# EAGLE design ChillerDisplay (EAGLE 7.3.0)
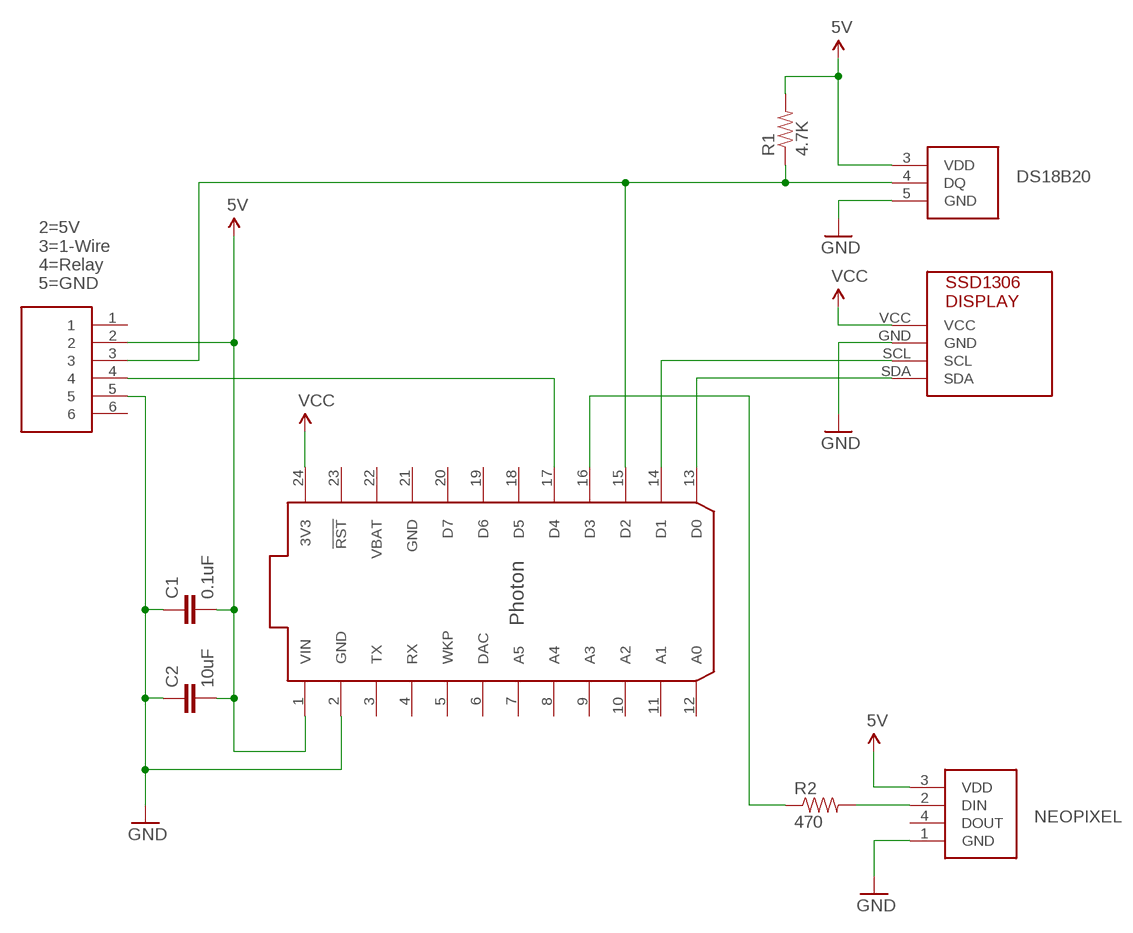
[diagram p0: schematic, sheet 1]

## Parts
C1  0.1uF  CAP-0.1UF-0603  [0603-CAP]
C2  10uF  CAP-10UF-0603  [0603-CAP]
J1  MODULAR-JACK-6P6C-1  [MODULAR-JACK-6P6C-1]
R1  4.7K  RES-4.7K-0603  [0603-RES]
R2  470  RES-470-0603  [0603-RES]
U$1  PHOTON  [PHOTON-SMD]
U$2  SSD1306REV-POL  [SSD1306-REV-POL]
U$3  DS18B208-SOIC  [DS18B20-S0]
U$4  SK6812  [SK6812]

## Nets
5V: C1.2 C2.2 J1.2 R1.2 U$1.1(VIN) U$3.3(VDD) U$4.3(VDD)
GND: C1.1 C2.1 J1.5 U$1.2(GND) U$2.GND U$3.5(GND) U$4.1(GND)
N$1: U$1.13(D0) U$2.SDA
N$2: U$1.14(D1) U$2.SCL
N$7: J1.3 R1.1 U$1.15(D2) U$3.4(DQ)
N$8: R2.2 U$4.2(DIN)
N$9: R2.1 U$1.16(D3)
N$10: J1.4 U$1.17(D4)
VCC: U$1.24(3V3) U$2.VCC
Unconnected: J1.1 J1.6 U$1.3(TX) U$1.4(RX) U$1.5(WKP) U$1.6(DAC) U$1.7(A5) U$1.8(A4) U$1.9(A3) U$1.10(A2) U$1.11(A1) U$1.12(A0) U$1.18(D5) U$1.19(D6) U$1.20(D7) U$1.23(!RST) U$4.4(DOUT)

## Notes on the sheet
- DS18B20
- 2=5V
  3=1-Wire
  4=Relay
  5=GND
- NEOPIXEL

## Power pins joined to a net without a drawn wire
GND: U$1.21(GND)
VBAT: U$1.22(VBAT)

## Library data of the parts
C1 = rickk2:CAP-0.1UF-0603: CAP CER 0.1UF 16V X7R 0603 https://www.digikey.com/product-detail/en/murata-electronics-north-america/GRM188R71C104KA01D/490-1532-1-ND/587771
C2 = rickk2:CAP-10UF-0603: CAP CER 10UF 16V X5R 0805 $ 0.21 https://www.digikey.com/product-detail/en/murata-electronics-north-america/GRM21BR61C106KE15L/490-3886-1-ND/965928
J1 = rickk2:MODULAR-JACK-6P6C-1: CONN MOD JACK 6P6C R/A UNSHLD $0.77 Stewart Connector SS-7066-NF Jack Modular Connector 6p6c (RJ11, RJ12, RJ14, RJ25) 90° Angle (Right) Unshielded Cat5 https://www.digikey.com/product-detail/en/stewart-connector/SS-7066-NF/380-1043-ND/388305
R1 = rickk2:RES-4.7K-0603: RES SMD 4.7K OHM 5% 1/4W 0603 $ 0.11 https://www.digikey.com/product-detail/en/panasonic-electronic-components/ERJ-PA3J472V/P4.7KBZCT-ND/5036332 Panasonic
R2 = rickk2:RES-470-0603: RES SMD 470 OHM 5% 1/10W 0603 Panasonic ERJ-3GEYJ471V 5% 0.1W, 1/10W Chip Resistor 0603 (1608 Metric) Automotive AEC-Q200 Thick Film https://www.digikey.com/product-detail/en/panasonic-electronic-components/ERJ-3GEYJ471V/P470GCT-ND/134802
U$1 = rickk2:PHOTON: PPTC121LFBN-RC $ 0.98 Description CONN HEADER FEM 12POS.1" SGL TIN Expanded Description 12 Position Header Connector 0.100" (2.54mm) Through Hole Tin Digikey: S6100-ND Sullins: PPTC121LFBN-RC https://www.digikey.com/product-detail/en/sullins-connector-solutions/PPTC121LFBN-RC/S6100-ND/807231 SMD version $ 1.69 12 Position Header, Top or Bottom Entry Connector 0.100" (2.54mm) Surface Mount Tin Digikey: S5604-ND Sullins: NPTC121KFXC-RC Nylon/Phosphor Bronze / Tin / 0.1” / 12 Pos / 1 Row / Single Row SMT / SMT Single Row Pin 1 Left / ROHS Compliant https://www.digikey.com/product-detail/en/sullins-connector-solutions/NPTC121KFXC-RC/S5604-ND/776062
U$2 = rickk2:SSD1306: Warning: Some SSD1306 boards have VCC and GND in opposite positions! Make sure you pick the correct one!
U$3 = rickk2:DS18B20
U$4 = rickk2:SK6812: NeoPixel SK6812/WS2812 https://www.digikey.com/product-detail/en/adafruit-industries-llc/1655/1528-1104-ND/5154679

## Board
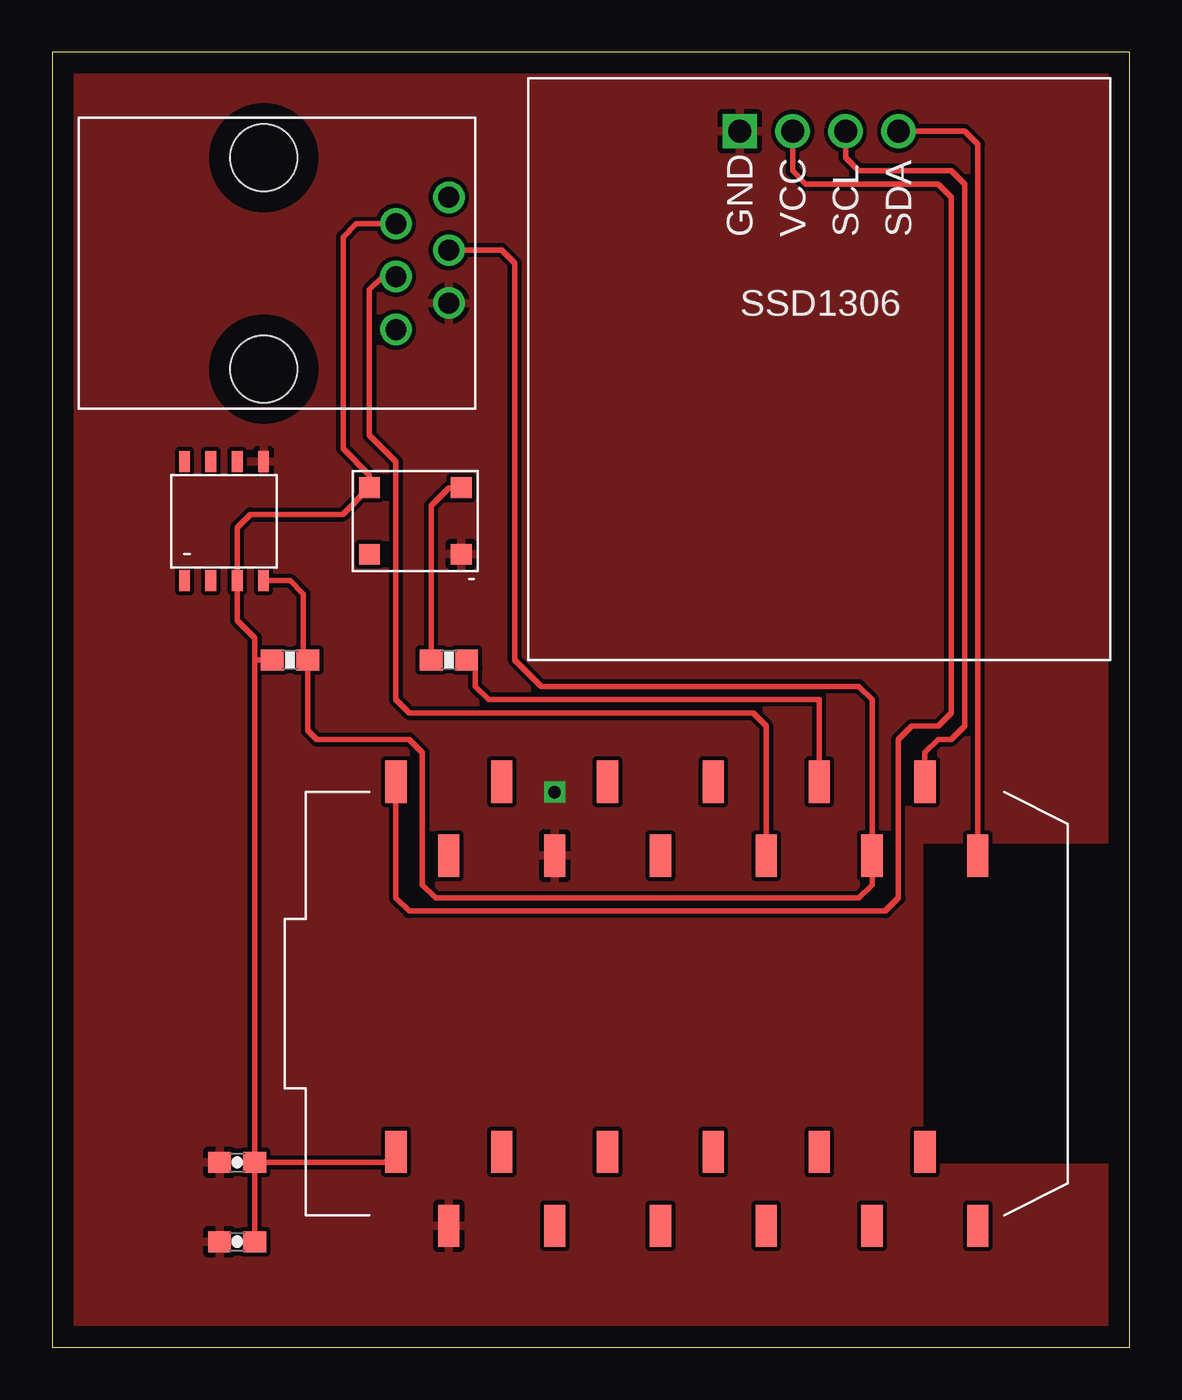
[diagram p1: board, top side]
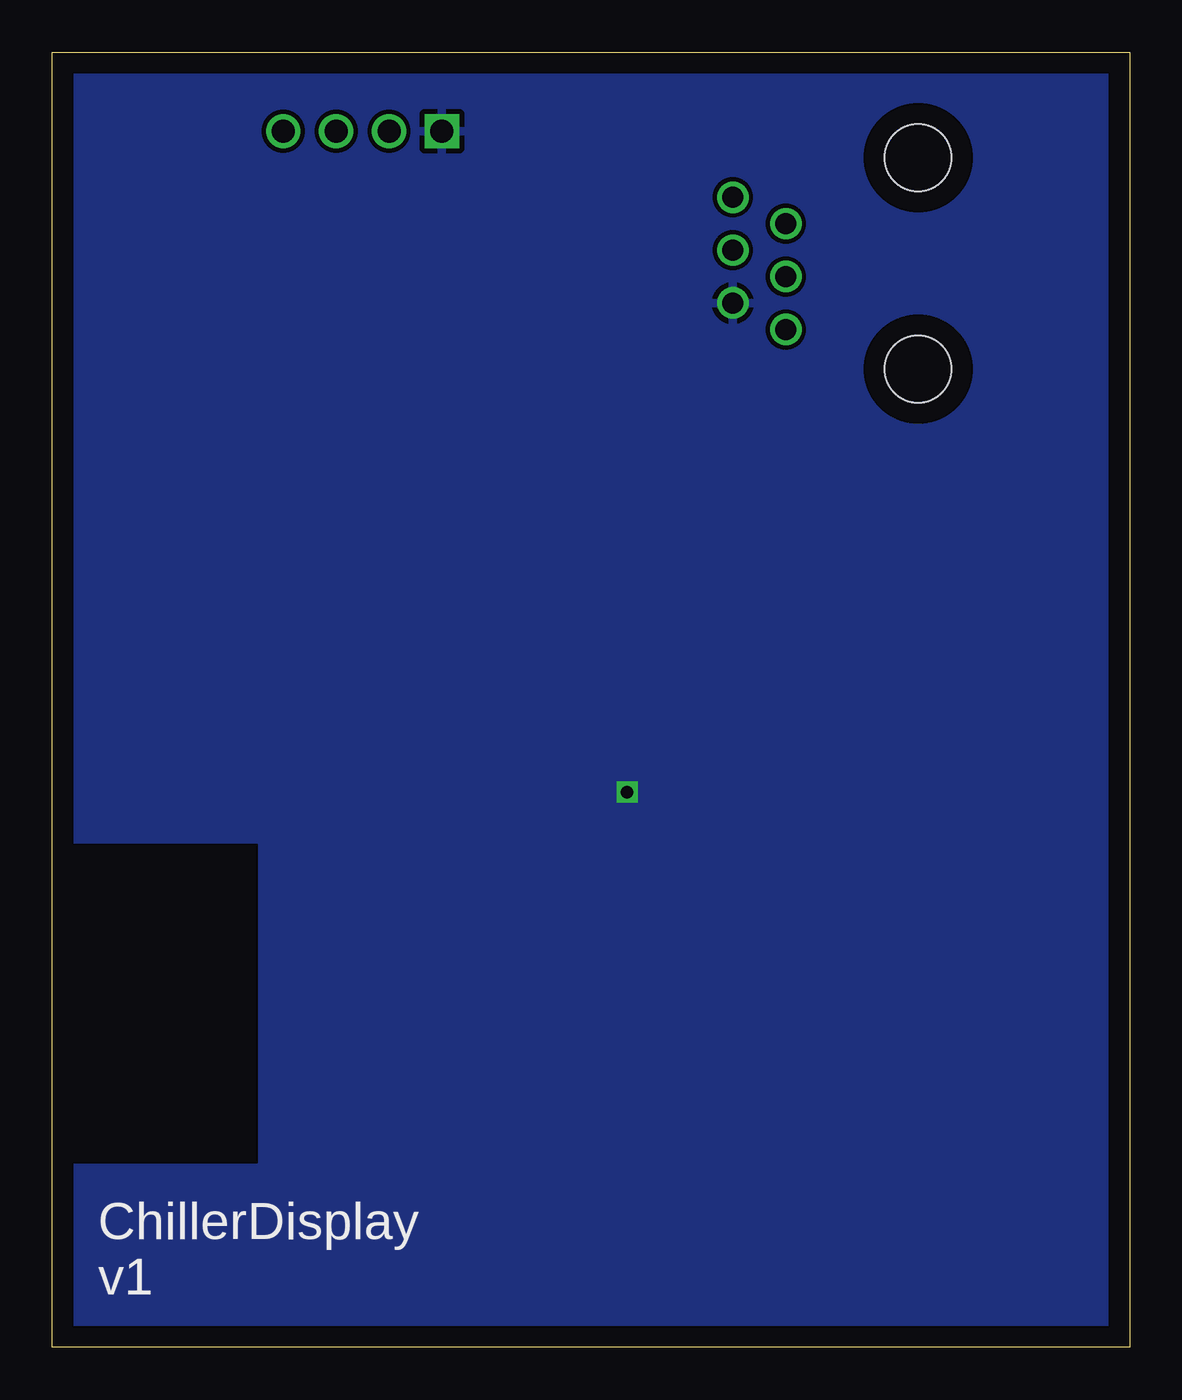
[diagram p2: board, bottom side, seen from below]

Size 51.74 x 62.22 mm. Coordinates in mm from the lower left corner, seen from the top.
Outline: 0,0 51.74,0 51.74,62.22 0,62.22 0,0
Copper layers (1*16): Top 0.035mm / dielectric 1.5mm / Bottom 0.035mm
Design rules "default": minimum track width 10mil, minimum drill 24mil, track to track 8mil, track to pad 8mil, pad to pad 8mil, via to via 8mil, smd to smd 8mil, copper to edge 40mil, drill to drill 8mil, minimum pad ring 10mil, minimum via ring 8mil, stop-mask expansion 4mil, vias tented up to drill 0mil, thermal gap 10mil

### Footprints (pad centres in the part's own frame; a part is rotated, then mirrored left to right if it is on the bottom)
0603-CAP = smd 1.1 x 1: 1 -0.85,0; 2 0.85,0
MODULAR-JACK-6P6C-1 = drill 1: 1 1.905,8.89; 2 3.175,6.35; 3 4.445,8.89; 4 5.715,6.35; 5 6.985,8.89; 6 8.255,6.35 | hole 3.2: 0,0; 10.16,0
0603-RES = smd 1.1 x 1: 1 -0.85,0; 2 0.85,0
PHOTON-SMD = smd 1.016 x 2.032: 1 0,1.778; 2 2.54,-1.778; 3 5.08,1.778; 4 7.62,-1.778; 5 10.16,1.778; 6 12.7,-1.778; 7 15.24,1.778; 8 17.78,-1.778; 9 20.32,1.778; 10 22.86,-1.778; 11 25.4,1.778; 12 27.94,-1.778; 13 27.94,16.002; 14 25.4,19.558; 15 22.86,16.002; 16 20.32,19.558; 17 17.78,16.002; 18 15.24,19.558; 19 12.7,16.002; 20 10.16,19.558; 21 7.62,16.002; 22 5.08,19.558; 23 2.54,16.002; 24 0,19.558
SSD1306-REV-POL = drill 1.1 square: GND 0,0 | drill 1.1: SCL 5.08,0; SDA 7.62,0; VCC 2.54,0
DS18B20-S0 = smd 0.508 x 1.016: 1 0,0; 2 1.27,0; 3 2.54,0; 4 3.81,0; 5 3.81,5.715; 6 2.54,5.715; 7 1.27,5.715; 8 0,5.715
SK6812 = smd 1 x 1: 1 4.4,0; 2 4.4,3.2; 3 0,3.2; 4 0,0

### Placement (x,y rotation side)
C1  8.89,5.08 0 top
C2  8.89,8.89 0 top
J1  10.16,57.15 270 top
R1  11.43,33.02 180 top
R2  19.05,33.02 180 top
U$1  16.51,7.62 0 top
U$2  33.02,58.42 0 top
U$3  6.35,36.83 0 top
U$4  15.24,38.1 0 top

### Tracks (layer width: path | path; a pad name or v marks a point on that pad's centre or on a via)
5V
  Top 0.254: C1.2 C2.2 | C2.2 16,8.89 U$1.1 | C2.2 9.74,33.02 | 9.74,33.02 9.74,34.08 8.89,34.92 U$3.3 8.89,39.37 9.53,40.01 13.95,40.01 U$4.3 15.24,41.91 13.97,43.18 13.97,53.34 14.61,53.98 J1.2 | R1.2 9.74,33.02
GND  (via drill 0.6)
  other vias: 24.13,26.67
  pour Bottom: 0,0 0,62.23 52.07,62.23 52.07,0
  pour Top: 0,0 0,62.23 52.07,62.23 52.07,0
N$1
  Top 0.254: U$1.13 44.45,57.78 43.81,58.42 U$2.SDA
N$2
  Top 0.254: U$1.14 41.91,28.57 42.55,29.21 43.18,29.21 43.81,29.84 43.81,55.88 43.18,56.52 38.73,56.52 38.1,57.15 U$2.SCL
N$7
  Top 0.254: U$3.4 11.43,36.83 12.06,36.2 12.06,33.23 R1.1 12.28,29.63 12.7,29.21 17.14,29.21 17.78,28.57 17.78,22.23 18.41,21.59 38.73,21.59 39.37,22.23 U$1.15 39.37,31.11 38.73,31.75 23.5,31.75 22.23,33.02 22.23,52.07 21.59,52.7 J1.3
N$8
  Top 0.254: R2.2 18.2,40.42 19.05,41.27 19.61,41.27 U$4.2
N$9
  Top 0.254: U$1.16 36.83,31.11 20.95,31.11 20.32,31.75 20.32,32.6 R2.1
N$10
  Top 0.254: J1.4 15.88,51.44 15.24,50.8 15.24,43.81 16.51,42.55 16.51,31.11 17.14,30.48 33.66,30.48 34.29,29.84 U$1.17
VCC
  Top 0.254: U$1.24 16.51,21.59 17.14,20.95 40.01,20.95 40.64,21.59 40.64,29.21 41.27,29.84 42.55,29.84 43.18,30.48 43.18,55.24 42.55,55.88 36.2,55.88 35.56,56.52 U$2.VCC

### Text on the board
bPlace: ChillerDisplay / v1